# Altium project xem7310_carrier.PrjPcb
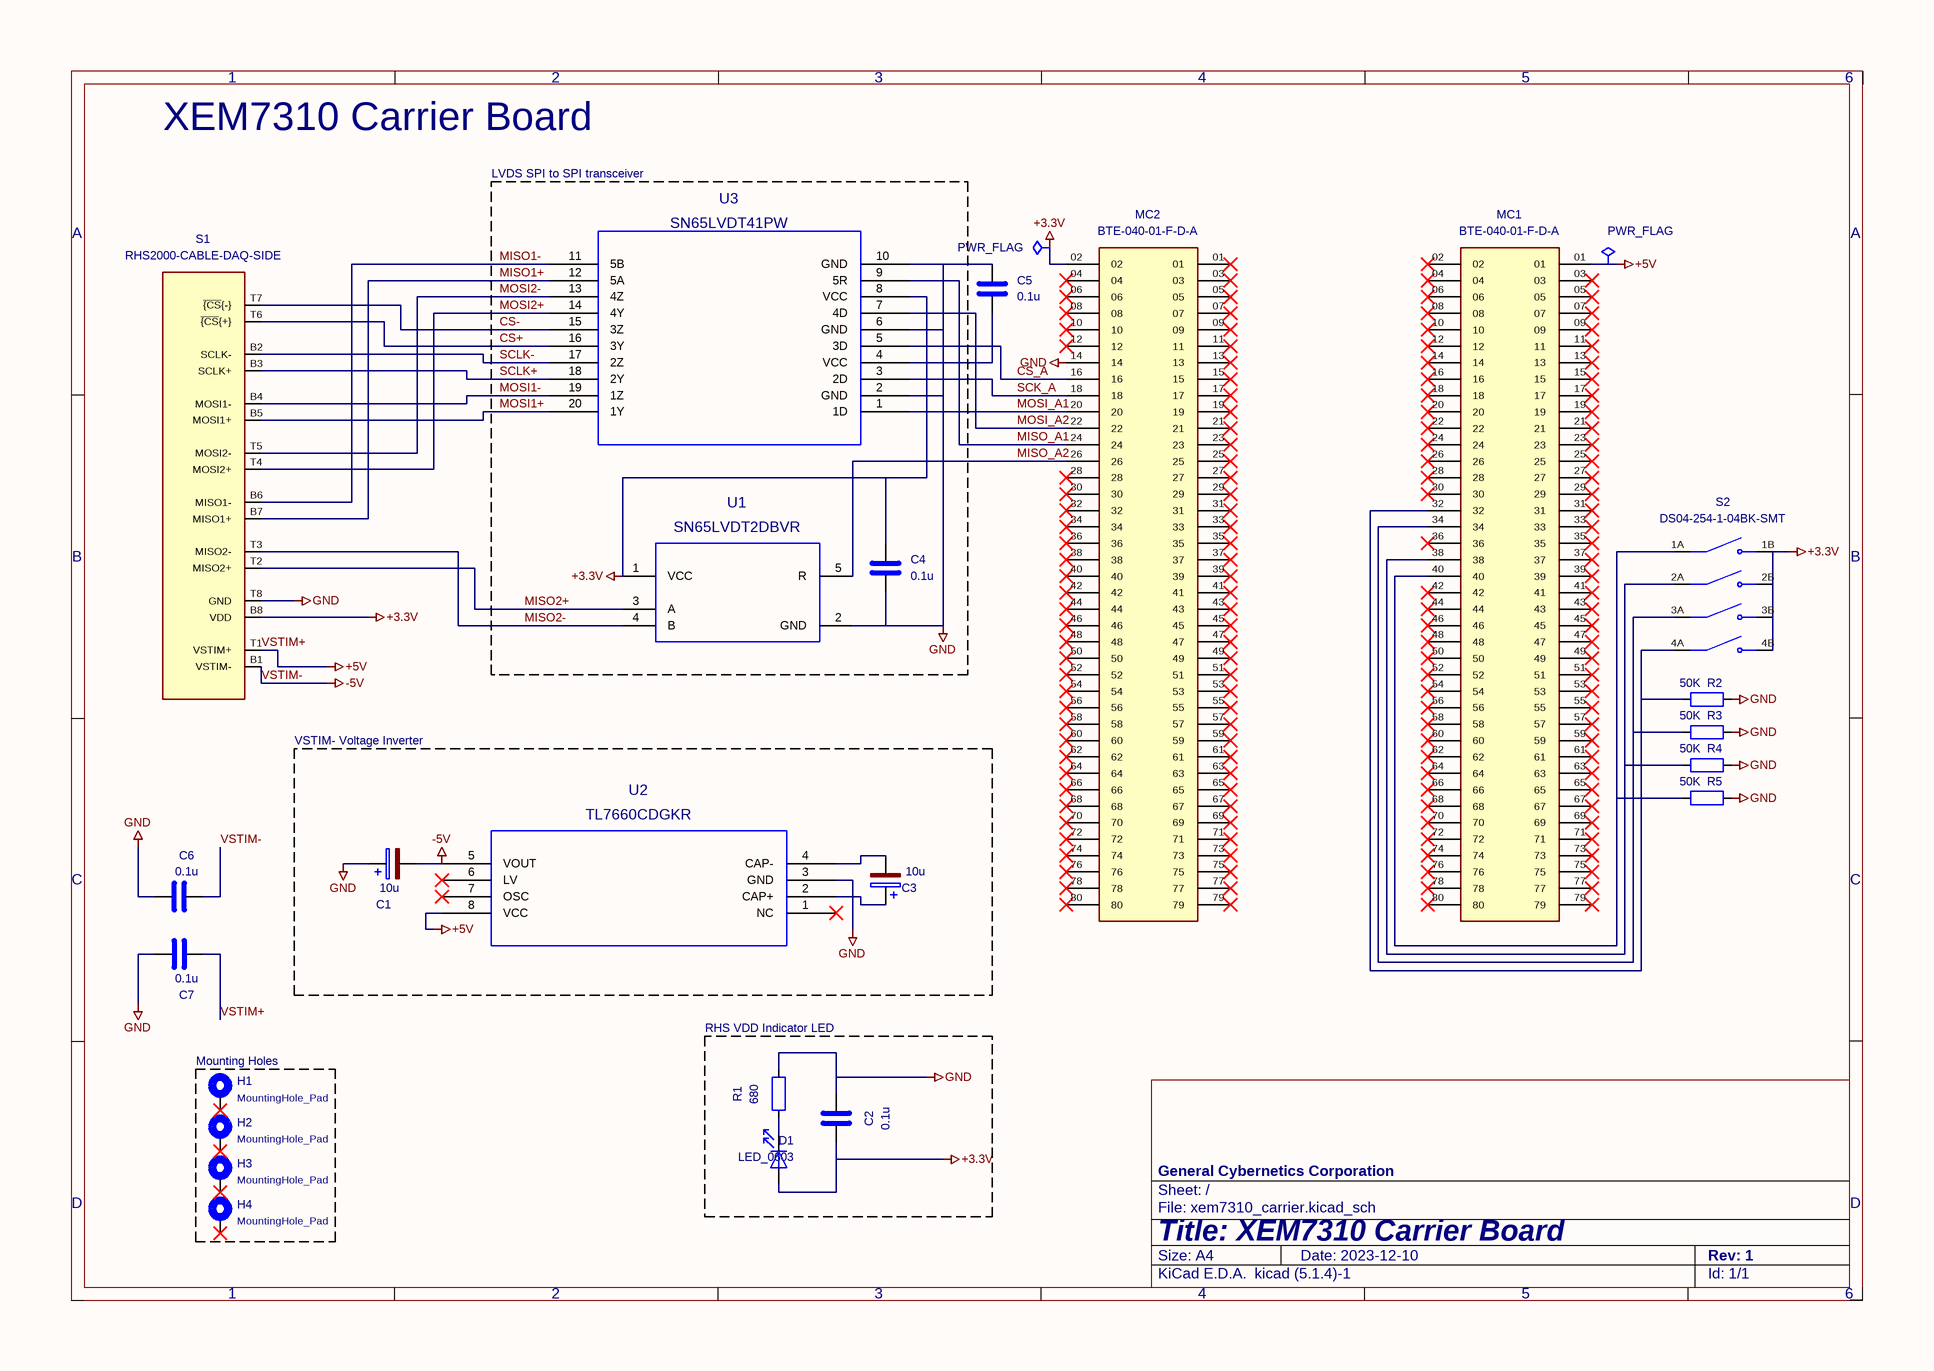
[diagram p0: xem7310_carrier.SchDoc]
1 sheet, 26 parts. Net scope: global (net labels, ports and power ports of the same name join across sheets).
Board file: xem7310_carrier.PcbDoc

## Sheet xem7310_carrier.SchDoc
size 297 x 209 mm

### Parts
#FLG0103  PWR_FLAG  (graphical)
#FLG?  PWR_FLAG  (graphical)
C1  10u  [CP_Elec_4x5.4]
C2  0.1u  [C_0402_1005Metric]
C3  10u  [CP_Elec_4x5.4]
C4  0.1u  [C_0402_1005Metric]
C5  0.1u  [C_0402_1005Metric]
C6  0.1u  [C_0402_1005Metric]
C7  0.1u  [C_0402_1005Metric]
D1  LED_0603  [LED_0603_1608Metric]
H1  MountingHole_Pad  [MountingHole_2.7mm_M2.5_DIN965_Pad]
H2  MountingHole_Pad  [MountingHole_2.7mm_M2.5_DIN965_Pad]
H3  MountingHole_Pad  [MountingHole_2.7mm_M2.5_DIN965_Pad]
H4  MountingHole_Pad  [MountingHole_2.7mm_M2.5_DIN965_Pad]
MC1  BTE-040-01-F-D-A  [SAMTEC_BTE-040-01-F-D-A]
MC2  BTE-040-01-F-D-A  [SAMTEC_BTE-040-01-F-D-A]
R1  680  [R_0603_1608Metric]
R2  50K  [R_0603_1608Metric]
R3  50K  [R_0603_1608Metric]
R4  50K  [R_0603_1608Metric]
R5  50K  [R_0603_1608Metric]
S1  RHS2000-CABLE-DAQ-SIDE
S2  DS04-254-1-04BK-SMT  [SW_DS04-254-1-04BK-SMT]
U1  SN65LVDT2DBVR  [DBV0005A_N]
U2  TL7660CDGKR  [DGK8]
U3  SN65LVDT41PW  [PW20]

### Blocks framed on the sheet
LVDS SPI to SPI transceiver: C4 U1 U3
VSTIM- Voltage Inverter: C1 C3 U2
RHS VDD Indicator LED: C2 D1 R1
Mounting Holes: H1-H4

### Nets
+3.3V: #FLG0103.1(pwr) C2.2 C4.1 C5.2 D1.2(A) MC2.02 S1.B8(VDD) S2.1B S2.2B S2.3B S2.4B U1.1(VCC) U3.4(VCC) U3.8(VCC)
GND: C1.1 C2.1 C4.2 C5.1 C6.1 C7.1 MC2.14 R1.2 R2.2 R3.2 R4.2 R5.2 S1.T8(GND) U1.2(GND) U2.3(GND) U3.2(GND) U3.6(GND) U3.10(GND)
VSTIM+: #FLG?.1(pwr) C7.2 MC1.01 S1.T1(VSTIM+) U2.8(VCC)  [also labelled +5V]
VSTIM-: C1.2 C6.2 S1.B1(VSTIM-) U2.5(VOUT)  [also labelled -5V]
CS+: S1.T6(~{{CS}{+}) U3.16(3Y)
CS-: S1.T7(~{{CS}{-}) U3.15(3Z)
CS_A: MC2.16 U3.5(3D)
MISO1+: S1.B7(MISO1+) U3.12(5A)
MISO1-: S1.B6(MISO1-) U3.11(5B)
MISO2+: S1.T2(MISO2+) U1.3(A)
MISO2-: S1.T3(MISO2-) U1.4(B)
MISO_A1: MC2.24 U3.9(5R)
MISO_A2: MC2.26 U1.5(R)
MOSI1+: S1.B5(MOSI1+) U3.20(1Y)
MOSI1-: S1.B4(MOSI1-) U3.19(1Z)
MOSI2+: S1.T4(MOSI2+) U3.14(4Y)
MOSI2-: S1.T5(MOSI2-) U3.13(4Z)
MOSI_A1: MC2.20 U3.1(1D)
MOSI_A2: MC2.22 U3.7(4D)
SCK_A: MC2.18 U3.3(2D)
SCLK+: S1.B3(SCLK+) U3.18(2Y)
SCLK-: S1.B2(SCLK-) U3.17(2Z)
NetC3_1: C3.1 U2.2(CAP+)
NetC3_2: C3.2 U2.4(CAP-)
NetD1_1: D1.1(K) R1.1
NetMC1_32: MC1.32 R2.1 S2.4A
NetMC1_34: MC1.34 R3.1 S2.3A
NetMC1_38: MC1.38 R4.1 S2.2A
NetMC1_40: MC1.40 R5.1 S2.1A

Not connected (* = marked no-connect by the designer): H1 1*; H2 1*; H3 1*; H4 1*; MC1 02* 03* 04* 05* 06* 07* 08* 09* 10* 11* 12* 13* 14* 15* 16* 17* 18* 19* 20* 21* 22* 23* 24* 25* 26* 27* 28* 29* 30* 31* 33* 35* 36* 37* 39* 41* 42* 43* 44* 45* 46* 47* 48* 49* 50* 51* 52* 53* 54* 55* 56* 57* 58* 59* 60* 61* 62* 63* 64* 65* 66* 67* 68* 69* 70* 71* 72* 73* 74* 75* 76* 77* 78* 79* 80*; MC2 01* 03* 04* 05* 06* 07* 08* 09* 10* 11* 12* 13* 15* 17* 19* 21* 23* 25* 27* 28* 29* 30* 31* 32* 33* 34* 35* 36* 37* 38* 39* 40* 41* 42* 43* 44* 45* 46* 47* 48* 49* 50* 51* 52* 53* 54* 55* 56* 57* 58* 59* 60* 61* 62* 63* 64* 65* 66* 67* 68* 69* 70* 71* 72* 73* 74* 75* 76* 77* 78* 79* 80*; U2 1(NC)* 6(LV)* 7(OSC)*

### Notes on the sheet
- XEM7310 Carrier Board
- 1
- 2
- 3
- 4
- 5
- 6
- A
- B
- C
- D
- Title: XEM7310 Carrier Board
- File: xem7310_carrier.kicad_sch
- Sheet: /
- General Cybernetics Corporation
- KiCad E.D.A.  kicad (5.1.4)-1
- Size: A4
- Date: 2023-12-10
- Rev: 1
- Id: 1/1

### Library data of the parts
C1 C3 = C_Polarized: Value: 10u; Footprint: Capacitor_SMD:CP_Elec_4x5.4
C2 C4-C7 = C: Value: 0.1u; Footprint: Capacitor_SMD:C_0402_1005Metric
D1 = LED: Value: LED_0603; Footprint: LED_SMD:LED_0603_1608Metric
MC1 MC2 = BTE-040-01-F-D-A: MANUFACTURER: Samtec; PARTREV: R; STANDARD: Manufacturer Recommendations; Value: BTE-040-01-F-D-A; Footprint: BTE-040-01-F-D-A:SAMTEC_BTE-040-01-F-D-A
R1-R5 = R: Footprint: Resistor_SMD:R_0603_1608Metric
  R1: Value: 680
  R2-R5: Value: 50K
S2 = DS04-254-1-04BK-SMT: MANUFACTURER: CUI Inc.; MF: CUI Devices; Description: 4 Position, Surface Mount, 2.54 mm Pitch, Raised Slide Actuator, Flat Bottom, SMT Pin, DIP Switch; MAXIMUM_PACKAGE_HEIGHT: 4.86 mm; Package: None; Price: None; Check_prices: https://www.snapeda.com/parts/DS04-254-1-04BK-SMT/CUI+Devices/view-part/?ref=eda; STANDARD: Manufacturer Recommendations; PARTREV: V0.0; SnapEDA_Link: https://www.snapeda.com/parts/DS04-254-1-04BK-SMT/CUI+Devices/view-part/?ref=snap; MP: DS04-254-1-04BK-SMT; Purchase-URL: https://www.snapeda.com/api/url_track_click_mouser/?unipart_id=4467256&manufacturer=CUI Devices&part_name=DS04-254-1-04BK-SMT&search_term=None; CUI_purchase_URL: https://www.cuidevices.com/product/switches/dip-switches/ds04-254-1-04bk-smt?utm_source=snapeda.com&utm_medium=referral&utm_campaign=snapedaBOM; Availability: In Stock; Value: DS04-254-1-04BK-SMT; Footprint: DS04-254-1-04BK-SMT:SW_DS04-254-1-04BK-SMT
#FLG0103 #FLG? = PWR_FLAG: Value: PWR_FLAG
H1-H4 = MountingHole_Pad: Value: MountingHole_Pad; Footprint: MountingHole:MountingHole_2.7mm_M2.5_DIN965_Pad
S1 = RHS2000-CABLE-DAQ-SIDE: Value: RHS2000-CABLE-DAQ-SIDE
U1 = SN65LVDT2DBVR: Value: SN65LVDT2DBVR; Footprint: FP_LVDT2:DBV0005A_N
U2 = TL7660CDGKR: Value: TL7660CDGKR; Footprint: TP_TL7660:DGK8
U3 = SN65LVDT41PW: Value: SN65LVDT41PW; Footprint: FP_LVDT41:PW20